# EAGLE schematic CERVEAU_02b (EAGLE 8.5.1)

## Sheet 1 of 3
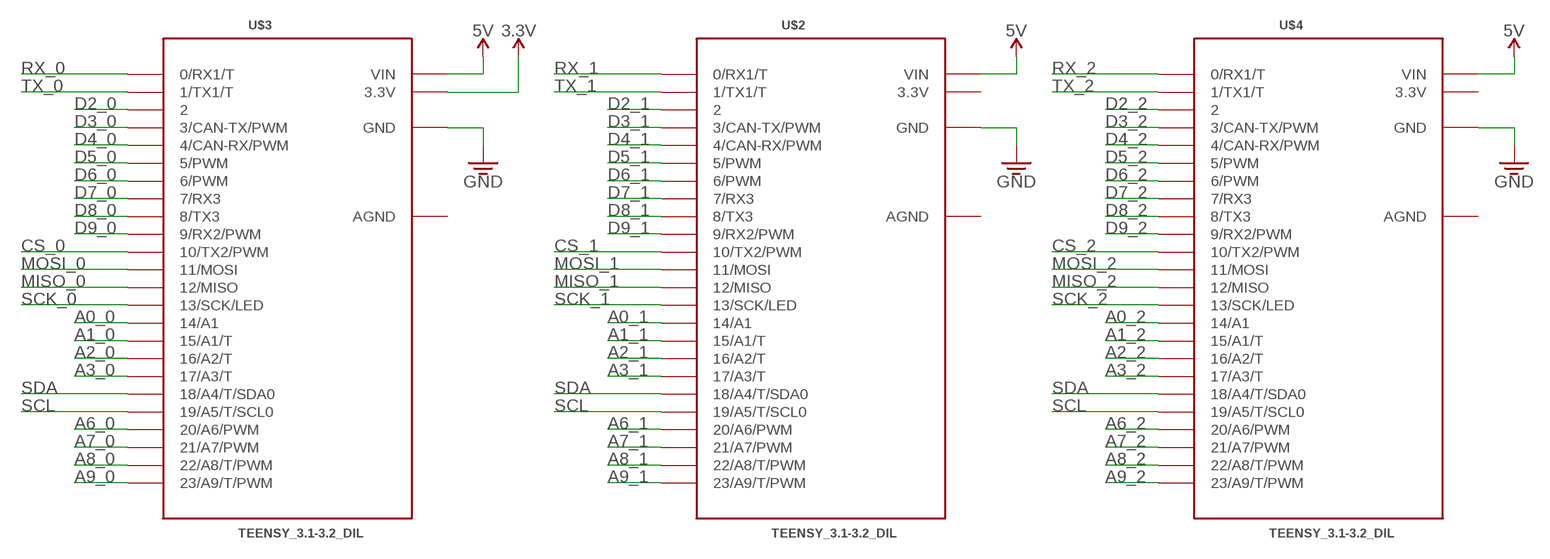
[diagram p0: schematic, sheet 1]

### Parts
U$2  TEENSY_3.1-3.2_DIL  [TEENSY_3.0-3.2&LC_DIL]
U$3  TEENSY_3.1-3.2_DIL  [TEENSY_3.0-3.2&LC_DIL]
U$4  TEENSY_3.1-3.2_DIL  [TEENSY_3.0-3.2&LC_DIL]

### Nets
3.3V: U$3.3.3V ; also sheet 2
5V: U$2.VIN U$3.VIN U$4.VIN ; also sheet 2,3
A0_0: U$3.14/A0(14/A1) ; also sheet 2
A0_1: U$2.14/A0(14/A1) ; also sheet 2
A0_2: U$4.14/A0(14/A1) ; also sheet 2
A1_0: U$3.15/A1(15/A1/T) ; also sheet 2
A1_1: U$2.15/A1(15/A1/T) ; also sheet 2
A1_2: U$4.15/A1(15/A1/T) ; also sheet 2
A2_0: U$3.16/A2(16/A2/T) ; also sheet 2
A2_1: U$2.16/A2(16/A2/T) ; also sheet 2
A2_2: U$4.16/A2(16/A2/T) ; also sheet 2
A3_0: U$3.17/A3(17/A3/T) ; also sheet 2
A3_1: U$2.17/A3(17/A3/T) ; also sheet 2
A3_2: U$4.17/A3(17/A3/T) ; also sheet 2
A6_0: U$3.20/A6(20/A6/PWM) ; also sheet 2
A6_1: U$2.20/A6(20/A6/PWM) ; also sheet 2
A6_2: U$4.20/A6(20/A6/PWM) ; also sheet 2
A7_0: U$3.21/A7(21/A7/PWM) ; also sheet 2
A7_1: U$2.21/A7(21/A7/PWM) ; also sheet 2
A7_2: U$4.21/A7(21/A7/PWM) ; also sheet 2
A8_0: U$3.22/A8(22/A8/T/PWM) ; also sheet 2
A8_1: U$2.22/A8(22/A8/T/PWM) ; also sheet 2
A8_2: U$4.22/A8(22/A8/T/PWM) ; also sheet 2
A9_0: U$3.23/A9(23/A9/T/PWM) ; also sheet 2
A9_1: U$2.23/A9(23/A9/T/PWM) ; also sheet 2
A9_2: U$4.23/A9(23/A9/T/PWM) ; also sheet 2
CS_0: U$3.10(10/TX2/PWM) ; also sheet 2
CS_1: U$2.10(10/TX2/PWM) ; also sheet 2
CS_2: U$4.10(10/TX2/PWM) ; also sheet 2
D2_0: U$3.2 ; also sheet 2
D2_1: U$2.2 ; also sheet 2
D2_2: U$4.2 ; also sheet 2
D3_0: U$3.3(3/CAN-TX/PWM) ; also sheet 2
D3_1: U$2.3(3/CAN-TX/PWM) ; also sheet 2
D3_2: U$4.3(3/CAN-TX/PWM) ; also sheet 2
D4_0: U$3.4(4/CAN-RX/PWM) ; also sheet 2
D4_1: U$2.4(4/CAN-RX/PWM) ; also sheet 2
D4_2: U$4.4(4/CAN-RX/PWM) ; also sheet 2
D5_0: U$3.5(5/PWM) ; also sheet 2
D5_1: U$2.5(5/PWM) ; also sheet 2
D5_2: U$4.5(5/PWM) ; also sheet 2
D6_0: U$3.6(6/PWM) ; also sheet 2
D6_1: U$2.6(6/PWM) ; also sheet 2
D6_2: U$4.6(6/PWM) ; also sheet 2
D7_0: U$3.7(7/RX3) ; also sheet 2
D7_1: U$2.7(7/RX3) ; also sheet 2
D7_2: U$4.7(7/RX3) ; also sheet 2
D8_0: U$3.8(8/TX3) ; also sheet 2
D8_1: U$2.8(8/TX3) ; also sheet 2
D8_2: U$4.8(8/TX3) ; also sheet 2
D9_0: U$3.9(9/RX2/PWM) ; also sheet 2
D9_1: U$2.9(9/RX2/PWM) ; also sheet 2
D9_2: U$4.9(9/RX2/PWM) ; also sheet 2
GND: U$2.GND U$3.GND U$4.GND ; also sheet 2,3
MISO_0: U$3.12(12/MISO) ; also sheet 2
MISO_1: U$2.12(12/MISO) ; also sheet 2
MISO_2: U$4.12(12/MISO) ; also sheet 2
MOSI_0: U$3.11(11/MOSI) ; also sheet 2
MOSI_1: U$2.11(11/MOSI) ; also sheet 2
MOSI_2: U$4.11(11/MOSI) ; also sheet 2
RX_0: U$3.0(0/RX1/T) ; also sheet 2
RX_1: U$2.0(0/RX1/T) ; also sheet 2
RX_2: U$4.0(0/RX1/T) ; also sheet 2
SCK_0: U$3.13(13/SCK/LED) ; also sheet 2
SCK_1: U$2.13(13/SCK/LED) ; also sheet 2
SCK_2: U$4.13(13/SCK/LED) ; also sheet 2
SCL: U$2.19/A5(19/A5/T/SCL0) U$3.19/A5(19/A5/T/SCL0) U$4.19/A5(19/A5/T/SCL0) ; also sheet 2
SDA: U$2.18/A4(18/A4/T/SDA0) U$3.18/A4(18/A4/T/SDA0) U$4.18/A4(18/A4/T/SDA0) ; also sheet 2
TX_0: U$3.1(1/TX1/T) ; also sheet 2
TX_1: U$2.1(1/TX1/T) ; also sheet 2
TX_2: U$4.1(1/TX1/T) ; also sheet 2

## Sheet 2 of 3
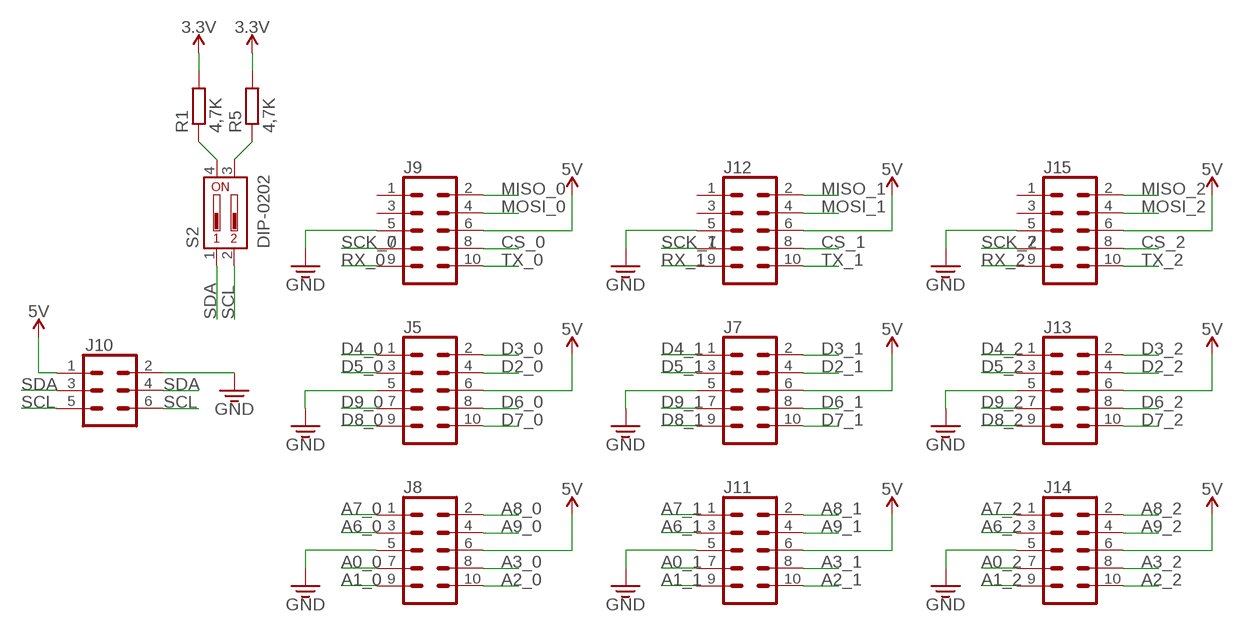
[diagram p1: schematic, sheet 2]

### Parts
J5  CONN_05X2SHD  [2X5-SHROUDED]
J7  CONN_05X2SHD  [2X5-SHROUDED]
J8  CONN_05X2SHD  [2X5-SHROUDED]
J9  CONN_05X2SHD  [2X5-SHROUDED]
J10  CONN_03X2SHROUD  [2X3-SHROUDED]
J11  CONN_05X2SHD  [2X5-SHROUDED]
J12  CONN_05X2SHD  [2X5-SHROUDED]
J13  CONN_05X2SHD  [2X5-SHROUDED]
J14  CONN_05X2SHD  [2X5-SHROUDED]
J15  CONN_05X2SHD  [2X5-SHROUDED]
R1  4,7K  R-EU_0207/10  [0207/10]
R5  4,7K  R-EU_0207/10  [0207/10]
S2  DIP-0202  [DIPSWITCH-02]

### Nets
3.3V: R1.2 R5.2 ; also sheet 1
5V: J5.6 J7.6 J8.6 J9.6 J10.1 J11.6 J12.6 J13.6 J14.6 J15.6 ; also sheet 1,3
A0_0: J8.7 ; also sheet 1
A0_1: J11.7 ; also sheet 1
A0_2: J14.7 ; also sheet 1
A1_0: J8.9 ; also sheet 1
A1_1: J11.9 ; also sheet 1
A1_2: J14.9 ; also sheet 1
A2_0: J8.10 ; also sheet 1
A2_1: J11.10 ; also sheet 1
A2_2: J14.10 ; also sheet 1
A3_0: J8.8 ; also sheet 1
A3_1: J11.8 ; also sheet 1
A3_2: J14.8 ; also sheet 1
A6_0: J8.3 ; also sheet 1
A6_1: J11.3 ; also sheet 1
A6_2: J14.3 ; also sheet 1
A7_0: J8.1 ; also sheet 1
A7_1: J11.1 ; also sheet 1
A7_2: J14.1 ; also sheet 1
A8_0: J8.2 ; also sheet 1
A8_1: J11.2 ; also sheet 1
A8_2: J14.2 ; also sheet 1
A9_0: J8.4 ; also sheet 1
A9_1: J11.4 ; also sheet 1
A9_2: J14.4 ; also sheet 1
CS_0: J9.8 ; also sheet 1
CS_1: J12.8 ; also sheet 1
CS_2: J15.8 ; also sheet 1
D2_0: J5.4 ; also sheet 1
D2_1: J7.4 ; also sheet 1
D2_2: J13.4 ; also sheet 1
D3_0: J5.2 ; also sheet 1
D3_1: J7.2 ; also sheet 1
D3_2: J13.2 ; also sheet 1
D4_0: J5.1 ; also sheet 1
D4_1: J7.1 ; also sheet 1
D4_2: J13.1 ; also sheet 1
D5_0: J5.3 ; also sheet 1
D5_1: J7.3 ; also sheet 1
D5_2: J13.3 ; also sheet 1
D6_0: J5.8 ; also sheet 1
D6_1: J7.8 ; also sheet 1
D6_2: J13.8 ; also sheet 1
D7_0: J5.10 ; also sheet 1
D7_1: J7.10 ; also sheet 1
D7_2: J13.10 ; also sheet 1
D8_0: J5.9 ; also sheet 1
D8_1: J7.9 ; also sheet 1
D8_2: J13.9 ; also sheet 1
D9_0: J5.7 ; also sheet 1
D9_1: J7.7 ; also sheet 1
D9_2: J13.7 ; also sheet 1
GND: J5.5 J7.5 J8.5 J9.5 J10.2 J11.5 J12.5 J13.5 J14.5 J15.5 ; also sheet 1,3
MISO_0: J9.2 ; also sheet 1
MISO_1: J12.2 ; also sheet 1
MISO_2: J15.2 ; also sheet 1
MOSI_0: J9.4 ; also sheet 1
MOSI_1: J12.4 ; also sheet 1
MOSI_2: J15.4 ; also sheet 1
N$4: R1.1 S2.4
N$5: R5.1 S2.3
RX_0: J9.9 ; also sheet 1
RX_1: J12.9 ; also sheet 1
RX_2: J15.9 ; also sheet 1
SCK_0: J9.7 ; also sheet 1
SCK_1: J12.7 ; also sheet 1
SCK_2: J15.7 ; also sheet 1
SCL: J10.5 J10.6 S2.2 ; also sheet 1
SDA: J10.3 J10.4 S2.1 ; also sheet 1
TX_0: J9.10 ; also sheet 1
TX_1: J12.10 ; also sheet 1
TX_2: J15.10 ; also sheet 1
Unconnected: J9.1 J9.3 J12.1 J12.3 J15.1 J15.3

## Sheet 3 of 3
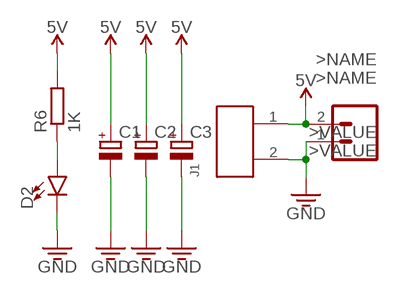
[diagram p2: schematic, sheet 3]

### Parts
C1  CPOL-EUE2.5-6  [E2,5-6]
C2  CPOL-EUE2.5-6  [E2,5-6]
C3  CPOL-EUE2.5-6  [E2,5-6]
D2  LED5MM  [LED_5MM]
J1  645002114822  [645002114822]
J2  CONN_02POLAR  [MOLEX-1X2]
R6  1K  R-EU_0207/10  [0207/10]

### Nets
5V: C1.+ C2.+ C3.+ J1.1 J2.2 R6.2 ; also sheet 1,2
GND: C1.- C2.- C3.- D2.K(C) J1.2 J2.1 ; also sheet 1,2
N$6: D2.A R6.1

## Power pins joined to a net without a drawn wire
AGND: U$2.AGND U$3.AGND U$4.AGND
GND: U$2.3.3V U$4.3.3V

## Library data of the parts
C1-C3 = rcl:CPOL-EU: POLARIZED CAPACITOR, European symbol
D2 = OPENBOT:LED: LED (Generic) Standard schematic elements and footprints for 5mm, 3mm, 1206, and 0603 sized LEDs. Generic LEDs with no color specified.
J1 = Wurth_Elektronik_Electromechanic_Wire_to_Board_Connectors_rev17b:645002114822: WR-WTB 3.96mm Male Locking Header, 2 Pins=>Code : Con_WTB_3.96_PCB_THT_645002114822 <http://katalog.we-online.de/media/thumbs2/eican/thb_Con_WTB_3.96_PCB_THT_6450xx114822_pf2.jpg> Details see: http://katalog.we-online.de/en/em/WTB_3_96_MALE_LOCKING_HEADER_6450XX114822 Created 2014-06-05, Karrer Zheng 2014 (C) Würth Elektronik
J2 = OPENBOT:CONN_02: Multi connection point. Often used as Generic Header-pin footprint for 0.1 inch spaced/style header connections On any of the 0.1 inch spaced packages, you can populate with these: Break Away Headers - Straight <https://www.sparkfun.com/products/116> (PRT-00116) Break Away Male Headers - Right Angle <https://www.sparkfun.com/products/553> (PRT-00553) Female Headers <https://www.sparkfun.com/products/115> (PRT-00115) Break Away Headers - Machine Pin <https://www.sparkfun.com/products/117> (PRT-00117) Break Away Female Headers - Swiss Machine Pin <https://www.sparkfun.com/products/743> (PRT-00743) For SCREWTERMINALS and SPRING TERMINALS visit here: Screw Terimnals on SparkFun.com <https://www.sparkfun.com/search/results?term=Screw+Terminals> (5mm/3.5mm/2.54mm spacing) This device is also useful as a general connection point to wire up your design to another part of your project. Our various solder wires solder well into these plated through hole pads. Hook-Up Wire - Assortment (Stranded, 22 AWG) <https://www.sparkfun.com/products/11375> (PRT-11375) Hook-Up Wire - Assortment (Solid Core, 22 AWG) <https://www.sparkfun.com/products/11367> (PRT-11367) View the entire wire category on our website here <https://www.sparkfun.com/categories/141> Special notes: Molex polarized connector foot print use with: PRT-08233 with associated crimp pins and housings. 2.54_SCREWTERM for use with PRT-10571. 3.5mm Screw Terminal footprints for PRT-08084 5mm Screw Terminal footprints for use with PRT-08432 Multi connection point. Often used as Generic Header-pin footprint for 0.1 inch spaced/style header connections On any of the 0.1 inch spaced packages, you can populate with these: Break Away Headers - Straight <https://www.sparkfun.com/products/116> (PRT-00116) Break Away Male Headers - Right Angle <https://www.sparkfun.com/products/553> (PRT-00553) Female Headers <https://www.sparkfun.com/products/115> (PRT-00115) Break Away Headers - Machine Pin <https://www.sparkfun.com/products/117> (PRT-00117) Break Away Female Headers - Swiss Machine Pin <https://www.sparkfun.com/products/743> (PRT-00743) For SCREWTERMINALS and SPRING TERMINALS visit here: Screw Terimnals on SparkFun.com <https://www.sparkfun.com/search/results?term=Screw+Terminals> (5mm/3.5mm/2.54mm spacing) This device is also useful as a general connection point to wire up your design to another part of your project. Our various solder wires solder well into these plated through hole pads. Hook-Up Wire - Assortment (Stranded, 22 AWG) <https://www.sparkfun.com/products/11375> (PRT-11375) Hook-Up Wire - Assortment (Solid Core, 22 AWG) <https://www.sparkfun.com/products/11367> (PRT-11367) View the entire wire category on our website here <https://www.sparkfun.com/categories/141> Special notes: Molex polarized connector foot print use with: PRT-08233 with associated crimp pins and housings. 2.54_SCREWTERM for use with PRT-10571. 3.5mm Screw Terminal footprints for PRT-08084 5mm Screw Terminal footprints for use with PRT-08432; SF_ID: PRT-09918
J5 J7-J9 J11-J15 = OPENBOT:CONN_05X2: Multi connection point. Often used as Generic Header-pin footprint for 0.1 inch spaced/style header connections For AVR SPI programming port, see special device with nice symbol: "AVR_SPI_PROG_5x2.dev" You can populate with any combo of single row headers, but if you'd like an exact match, check these: 2x5 AVR ICSP Male Header <https://www.sparkfun.com/products/778> (PRT-00778) 2x5 Pin Shrouded Header <https://www.sparkfun.com/products/8506> (PRT-08506) On any of the 0.1 inch spaced packages, you can populate with these: Break Away Headers - Straight <https://www.sparkfun.com/products/116> (PRT-00116) Break Away Male Headers - Right Angle <https://www.sparkfun.com/products/553> (PRT-00553) Female Headers <https://www.sparkfun.com/products/115> (PRT-00115) Break Away Headers - Machine Pin <https://www.sparkfun.com/products/117> (PRT-00117) Break Away Female Headers - Swiss Machine Pin <https://www.sparkfun.com/products/743> (PRT-00743) Special note: the shrouded connector mates well with our 5x2 ribbon cables: 2x5 Pin IDC Ribbon Cable <https://www.sparkfun.com/products/8535> (PRT-08535); PROD_ID: CONN-08671; SF_ID: PRT-08506
J10 = OPENBOT:CONN_03X2: Multi connection point. Often used as Generic Header-pin footprint for 0.1 inch spaced/style header connections You can populate with any combo of single row headers, but if you'd like an exact match, check these: Header - 2x3 (Male, 0.1") <https://www.sparkfun.com/products/12807> (PRT-12807) Header - 2x3 (Female, 0.1") <https://www.sparkfun.com/products/13010> (PRT-13010) 2x3 Pin Shrouded Header <https://www.sparkfun.com/products/10877> (PRT-10877) On any of the 0.1 inch spaced packages, you can populate with these: Break Away Headers - Straight <https://www.sparkfun.com/products/116> (PRT-00116) Break Away Male Headers - Right Angle <https://www.sparkfun.com/products/553> (PRT-00553) Female Headers <https://www.sparkfun.com/products/115> (PRT-00115) Break Away Headers - Machine Pin <https://www.sparkfun.com/products/117> (PRT-00117) Break Away Female Headers - Swiss Machine Pin <https://www.sparkfun.com/products/743> (PRT-00743) Special note: the shrouded connector mates well with our 3x2 ribbon cables: Ribbon Crimp Connector - 6-pin (2x3, Female) <https://www.sparkfun.com/products/10651> (PRT-10651) Ribbon Cable - 6 wire (15ft) <https://www.sparkfun.com/products/10646> (PRT-10646); PROD_ID: CONN-10681; SF_ID: PRT_10877
R1 R5 R6 = rcl:R-EU_: RESISTOR, European symbol
S2 = SparkFun-Retired:DIP-02: SMD dip switch 2 positions
U$2-U$4 = Teensy_3_and_LC_Series_Boards_v1.4:TEENSY_3.1-3.2_DIL: Teensy 3.1 or 3.2 in a DIL Layout.